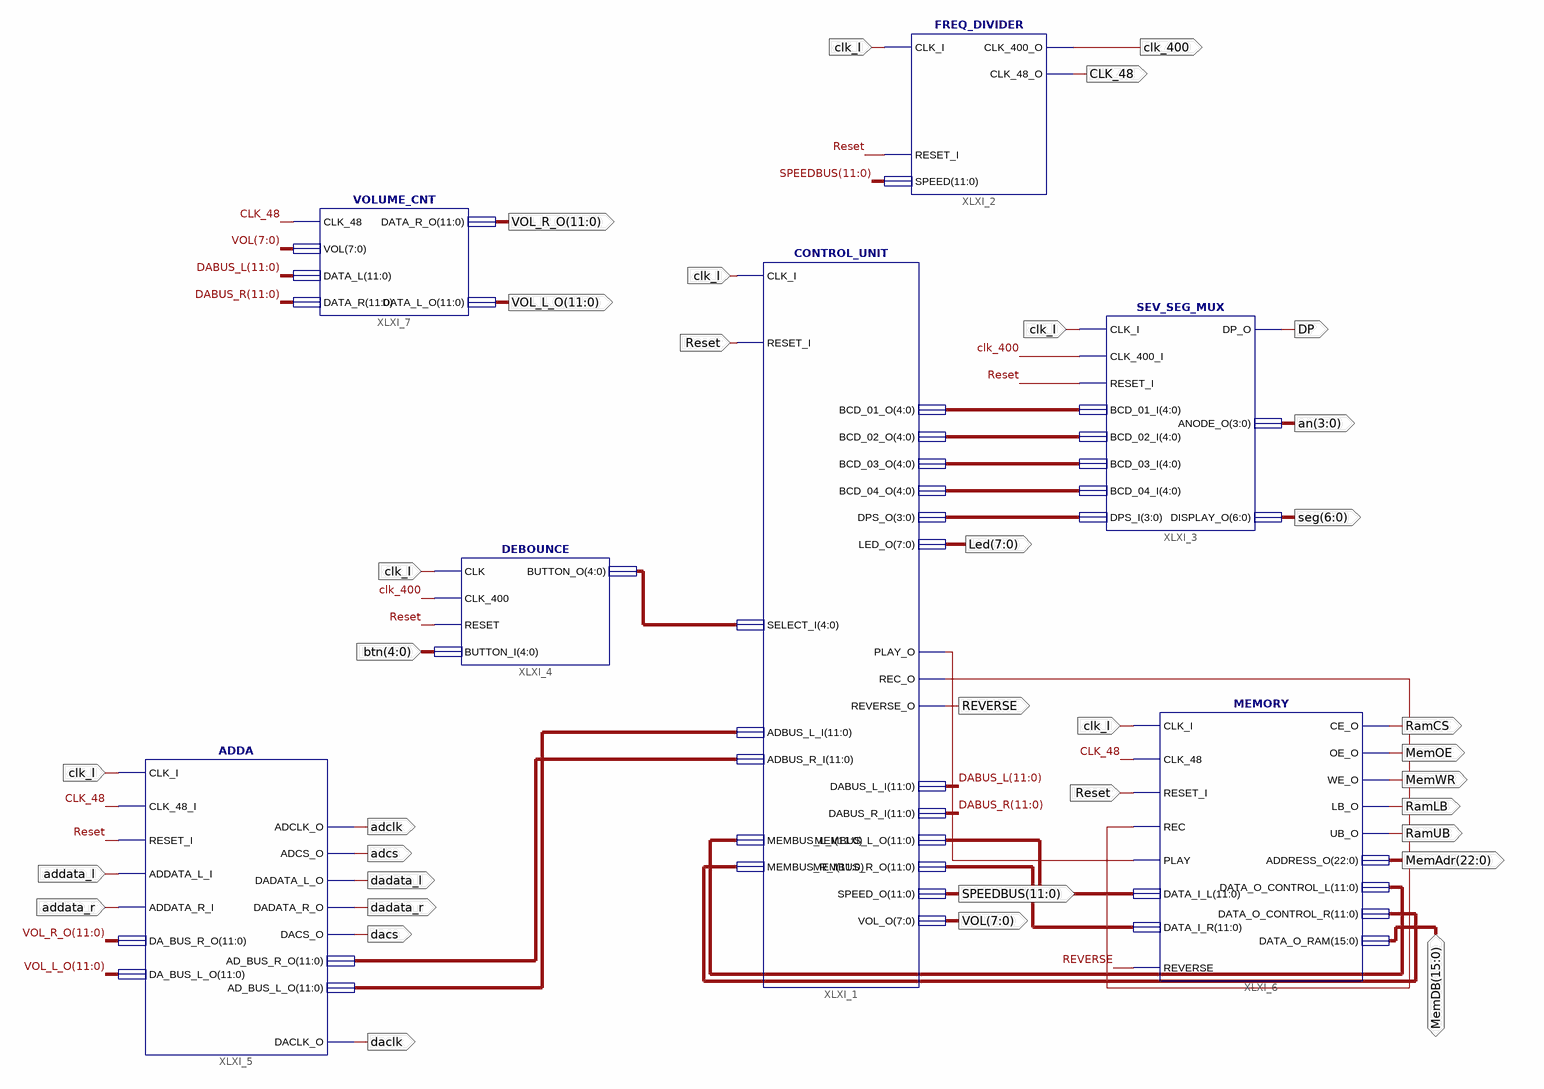
[diagram p0: schematic sheet 1]
// Xilinx ISE schematic TOP_ENTITY.sch (spartan6) as structural Verilog: 7 symbols, 29 ports
module TOP_ENTITY (
  input  clk_I,
  input  Reset,
  input  [4:0] btn,
  input  addata_l,
  input  addata_r,
  inout  [15:0] MemDB,
  output [3:0] an,
  output [6:0] seg,
  output DP,
  output [7:0] Led,
  output clk_400,
  output adclk,
  output adcs,
  output CLK_48,
  output dacs,
  output dadata_r,
  output dadata_l,
  output daclk,
  output [22:0] MemAdr,
  output RamCS,
  output MemOE,
  output MemWR,
  output RamLB,
  output RamUB,
  output REVERSE,
  output [11:0] SPEEDBUS,
  output [7:0] VOL,
  output [11:0] VOL_R_O,
  output [11:0] VOL_L_O
);

  wire XLXN_21, XLXN_22;
  wire [3:0] XLXN_6;
  wire [4:0] XLXN_1, XLXN_2, XLXN_3, XLXN_4, XLXN_15;
  wire [11:0] DABUS_L, DABUS_R, XLXN_16, XLXN_17, XLXN_23, XLXN_24, XLXN_25, XLXN_26;

  CONTROL_UNIT XLXI_1 (
    .CLK_I(clk_I), .RESET_I(Reset), .ADBUS_L_I(XLXN_16), .ADBUS_R_I(XLXN_17), .MEMBUS_L_I(XLXN_26),
    .MEMBUS_R_I(XLXN_25), .SELECT_I(XLXN_15), .PLAY_O(XLXN_21), .REC_O(XLXN_22), .REVERSE_O(REVERSE),
    .BCD_01_O(XLXN_1), .BCD_02_O(XLXN_2), .BCD_03_O(XLXN_3), .BCD_04_O(XLXN_4), .LED_O(Led), .DPS_O(XLXN_6),
    .DABUS_L_I(DABUS_L), .DABUS_R_I(DABUS_R), .SPEED_O(SPEEDBUS), .MEMBUS_L_O(XLXN_23), .MEMBUS_R_O(XLXN_24),
    .VOL_O(VOL));
  FREQ_DIVIDER XLXI_2 (.CLK_I(clk_I), .RESET_I(Reset), .SPEED(SPEEDBUS), .CLK_400_O(clk_400), .CLK_48_O(CLK_48));
  SEV_SEG_MUX XLXI_3 (
    .CLK_I(clk_I), .CLK_400_I(clk_400), .RESET_I(Reset), .BCD_01_I(XLXN_1), .BCD_02_I(XLXN_2),
    .BCD_03_I(XLXN_3), .BCD_04_I(XLXN_4), .DPS_I(XLXN_6), .DP_O(DP), .ANODE_O(an), .DISPLAY_O(seg));
  DEBOUNCE XLXI_4 (.CLK(clk_I), .CLK_400(clk_400), .RESET(Reset), .BUTTON_I(btn), .BUTTON_O(XLXN_15));
  ADDA XLXI_5 (
    .CLK_I(clk_I), .CLK_48_I(CLK_48), .RESET_I(Reset), .ADDATA_L_I(addata_l), .ADDATA_R_I(addata_r),
    .DA_BUS_R_O(VOL_R_O), .DA_BUS_L_O(VOL_L_O), .ADCLK_O(adclk), .ADCS_O(adcs), .DADATA_L_O(dadata_l),
    .DADATA_R_O(dadata_r), .DACLK_O(daclk), .DACS_O(dacs), .AD_BUS_R_O(XLXN_17), .AD_BUS_L_O(XLXN_16));
  MEMORY XLXI_6 (
    .CLK_I(clk_I), .CLK_48(CLK_48), .RESET_I(Reset), .REC(XLXN_22), .PLAY(XLXN_21), .DATA_I_L(XLXN_23),
    .DATA_I_R(XLXN_24), .DATA_O_RAM(MemDB), .CE_O(RamCS), .OE_O(MemOE), .WE_O(MemWR), .LB_O(RamLB),
    .UB_O(RamUB), .ADDRESS_O(MemAdr), .DATA_O_CONTROL_L(XLXN_26), .DATA_O_CONTROL_R(XLXN_25),
    .REVERSE(REVERSE));
  VOLUME_CNT XLXI_7 (
    .CLK_48(CLK_48), .VOL(VOL), .DATA_L(DABUS_L), .DATA_R(DABUS_R), .DATA_R_O(VOL_R_O), .DATA_L_O(VOL_L_O));
endmodule
